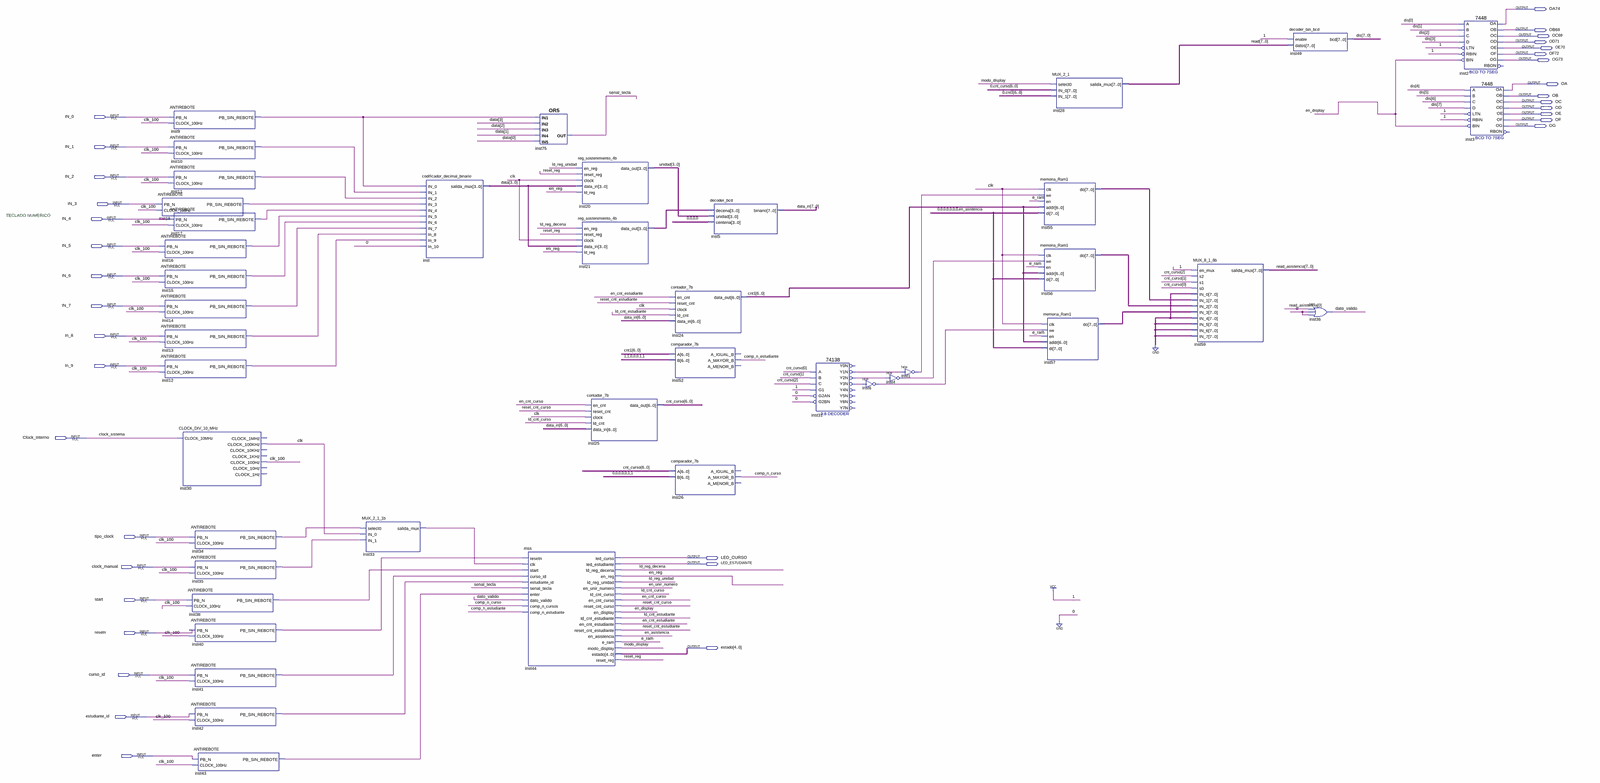
[diagram p0: schematic sheet, whole]
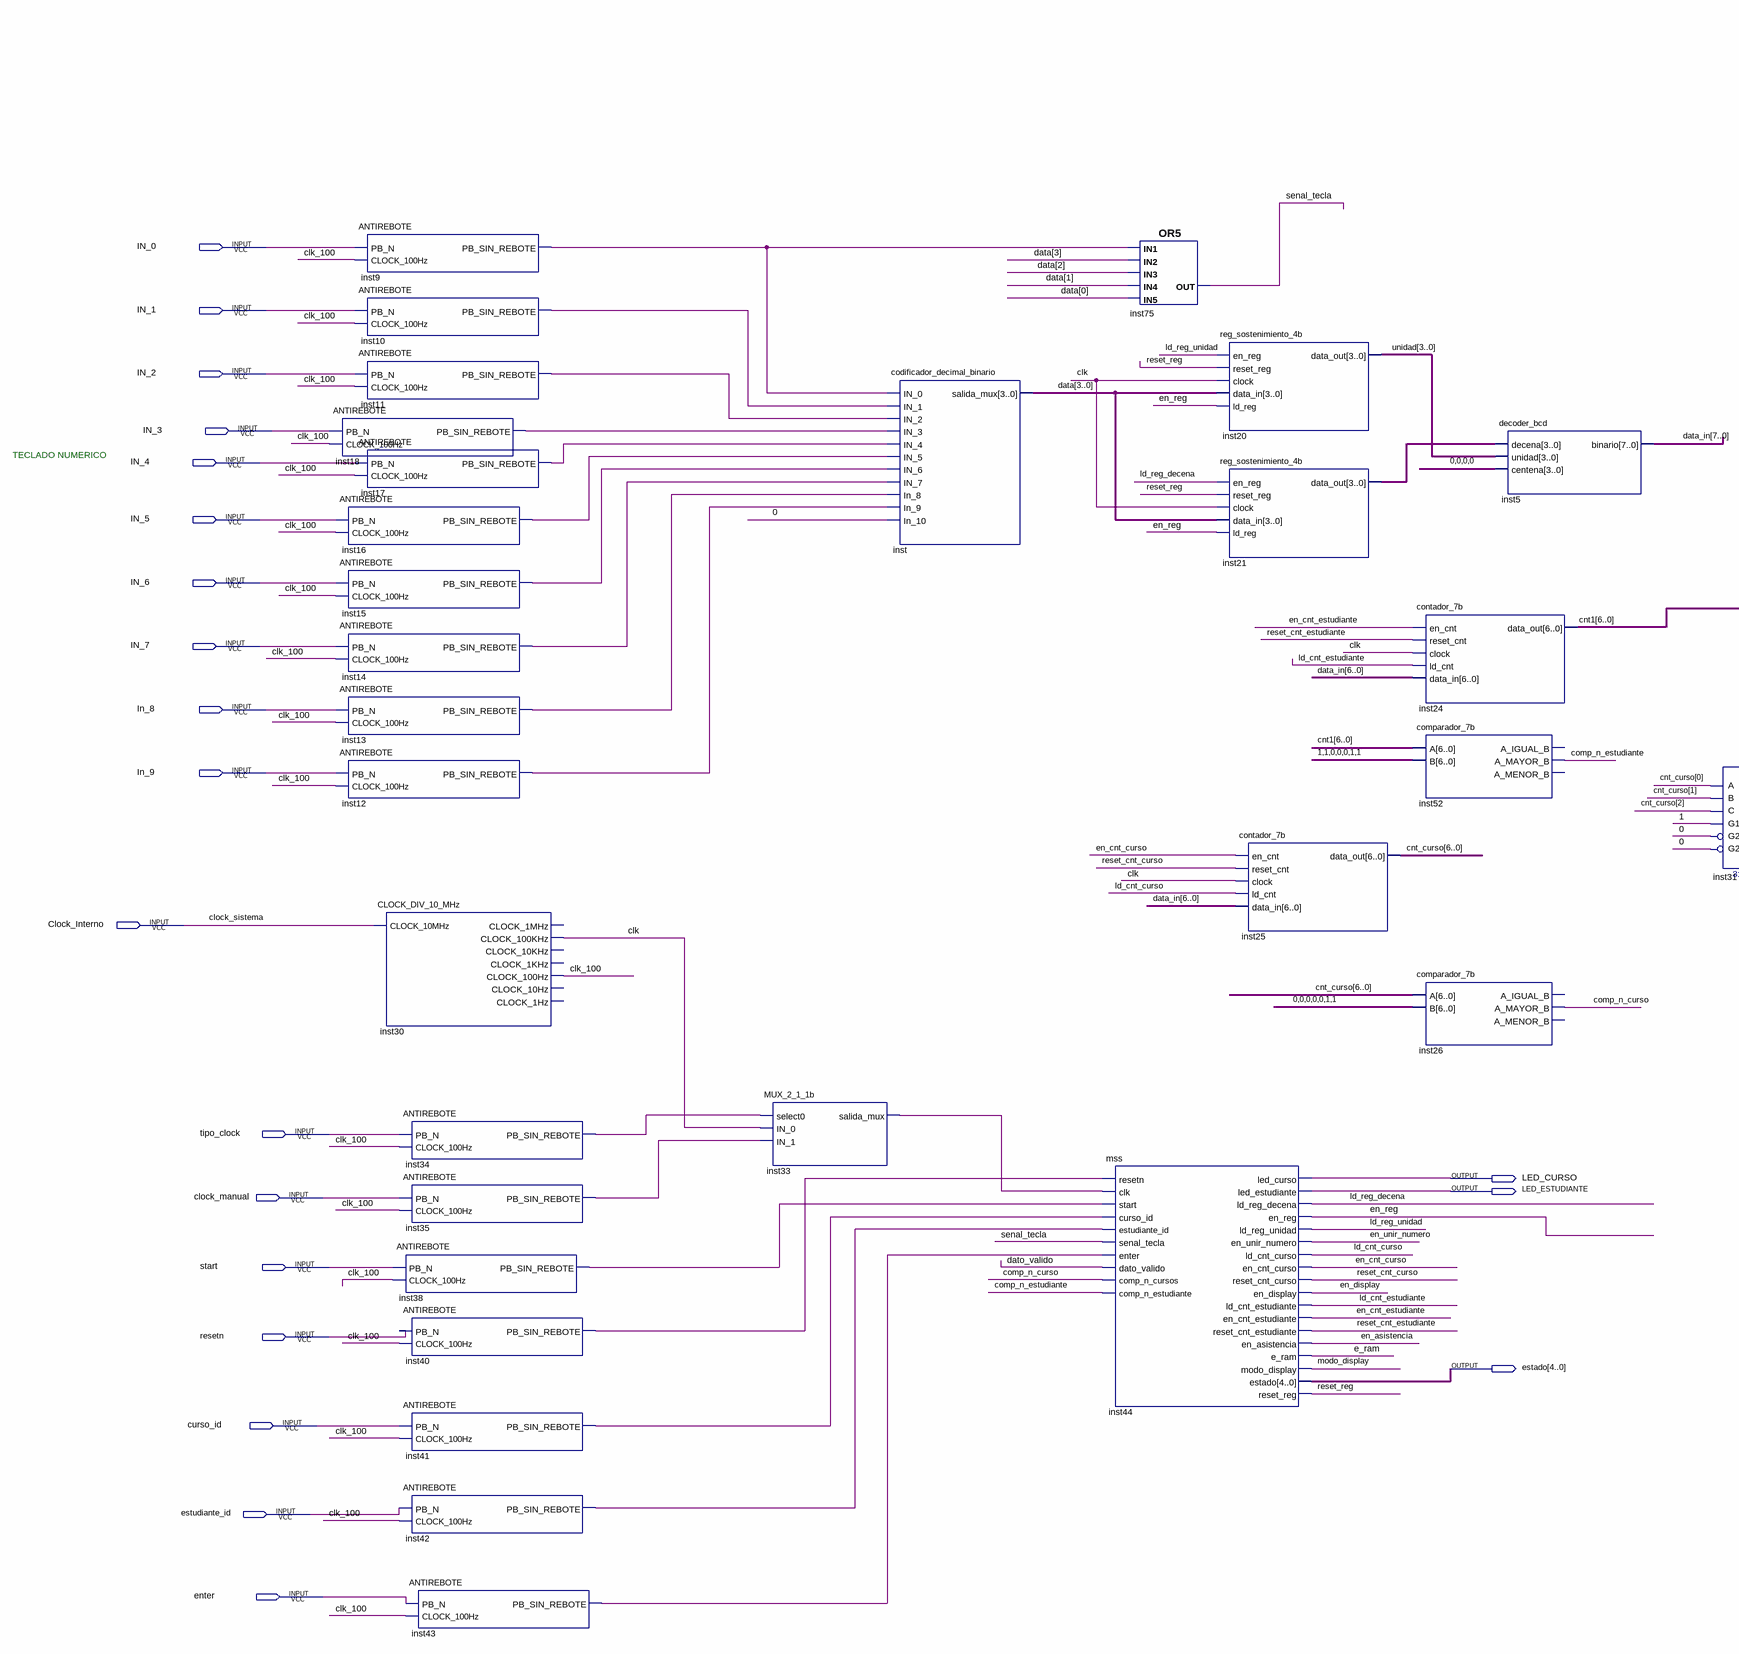
[diagram p1: schematic sheet, left part]
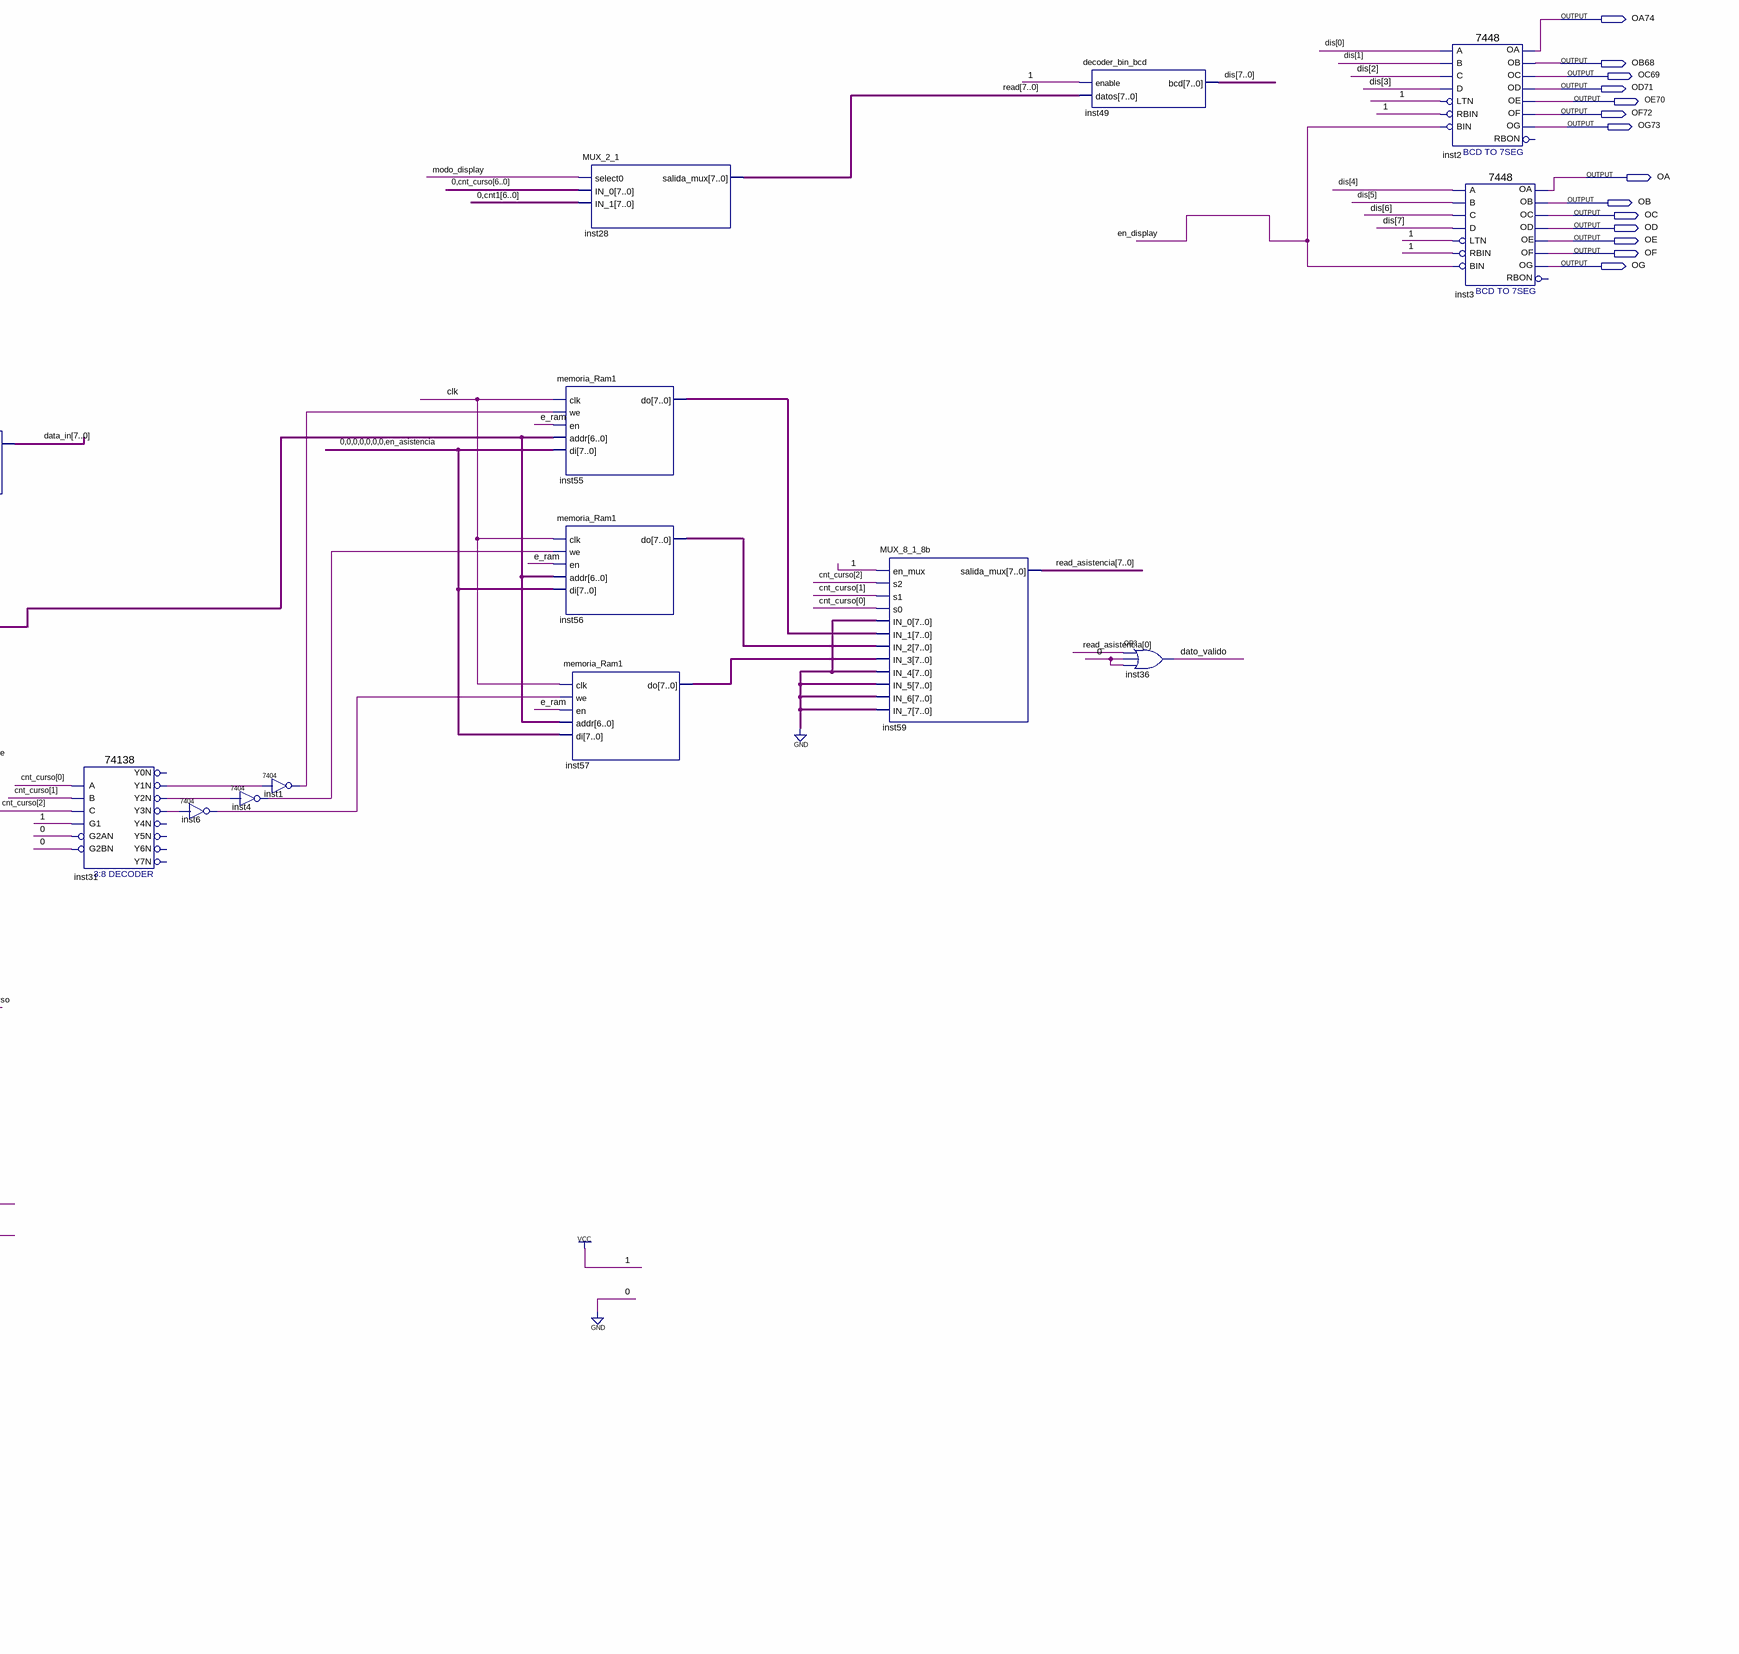
[diagram p2: schematic sheet, right part]
// Quartus schematic marcacionBDF.bdf as structural Verilog: 42 symbols, 35 pins
module marcacionBDF (
  input  IN_0,
  input  IN_1,
  input  IN_2,
  input  IN_3,
  input  IN_4,
  input  IN_5,
  input  IN_6,
  input  IN_7,
  input  In_8,
  input  In_9,
  input  Clock_Interno,
  input  tipo_clock,
  input  clock_manual,
  input  start,
  input  resetn,
  input  curso_id,
  input  estudiante_id,
  input  enter,
  output OA74,
  output OB68,
  output OC69,
  output OD71,
  output OE70,
  output OF72,
  output OG73,
  output OA,
  output OB,
  output OC,
  output OD,
  output OE,
  output OF,
  output OG,
  output LED_CURSO,
  output LED_ESTUDIANTE,
  output [4:0] estado
);

  wire clk, clk_100, comp_n_curso, comp_n_estudiante, dato_valido, e_ram, en_asistencia, en_cnt_curso,
       en_cnt_estudiante, en_display, en_reg, en_unir_numero, inst1_1, inst4_1, inst6_1, inst9_pb_sin_rebote,
       inst10_pb_sin_rebote, inst11_pb_sin_rebote, inst12_pb_sin_rebote, inst13_pb_sin_rebote,
       inst14_pb_sin_rebote, inst15_pb_sin_rebote, inst16_pb_sin_rebote, inst17_pb_sin_rebote,
       inst18_pb_sin_rebote, inst31_y1n, inst31_y2n, inst31_y3n, inst33_salida_mux, inst34_pb_sin_rebote,
       inst35_pb_sin_rebote, inst38_pb_sin_rebote, inst40_pb_sin_rebote, inst41_pb_sin_rebote,
       inst42_pb_sin_rebote, inst43_pb_sin_rebote, ld_cnt_curso, ld_cnt_estudiante, ld_reg_decena,
       ld_reg_unidad, modo_display, reset_cnt_curso, reset_cnt_estudiante, reset_reg, senal_tecla;
  wire [3:0] data, inst21_data_out, unidad;
  wire [6:0] cnt1, cnt_curso;
  wire [7:0] data_in, dis, inst55_do, inst56_do, inst57_do, read, read_asistencia;

  ANTIREBOTE inst9 (.PB_N(IN_0), .CLOCK_100Hz(clk_100), .PB_SIN_REBOTE(inst9_pb_sin_rebote));
  ANTIREBOTE inst10 (.PB_N(IN_1), .CLOCK_100Hz(clk_100), .PB_SIN_REBOTE(inst10_pb_sin_rebote));
  ANTIREBOTE inst11 (.PB_N(IN_2), .CLOCK_100Hz(clk_100), .PB_SIN_REBOTE(inst11_pb_sin_rebote));
  ANTIREBOTE inst18 (.PB_N(IN_3), .CLOCK_100Hz(clk_100), .PB_SIN_REBOTE(inst18_pb_sin_rebote));
  ANTIREBOTE inst17 (.PB_N(IN_4), .CLOCK_100Hz(clk_100), .PB_SIN_REBOTE(inst17_pb_sin_rebote));
  ANTIREBOTE inst16 (.PB_N(IN_5), .CLOCK_100Hz(clk_100), .PB_SIN_REBOTE(inst16_pb_sin_rebote));
  ANTIREBOTE inst15 (.PB_N(IN_6), .CLOCK_100Hz(clk_100), .PB_SIN_REBOTE(inst15_pb_sin_rebote));
  ANTIREBOTE inst14 (.PB_N(IN_7), .CLOCK_100Hz(clk_100), .PB_SIN_REBOTE(inst14_pb_sin_rebote));
  ANTIREBOTE inst13 (.PB_N(In_8), .CLOCK_100Hz(clk_100), .PB_SIN_REBOTE(inst13_pb_sin_rebote));
  ANTIREBOTE inst12 (.PB_N(In_9), .CLOCK_100Hz(clk_100), .PB_SIN_REBOTE(inst12_pb_sin_rebote));
  CLOCK_DIV_10_MHz inst30 (
    .CLOCK_10MHz(Clock_Interno), .CLOCK_100KHz(clk), .CLOCK_100Hz(clk_100));  // open: CLOCK_1MHz, CLOCK_10KHz, CLOCK_1KHz, CLOCK_10Hz, CLOCK_1Hz
  ANTIREBOTE inst34 (.PB_N(tipo_clock), .CLOCK_100Hz(clk_100), .PB_SIN_REBOTE(inst34_pb_sin_rebote));
  ANTIREBOTE inst35 (.PB_N(clock_manual), .CLOCK_100Hz(clk_100), .PB_SIN_REBOTE(inst35_pb_sin_rebote));
  ANTIREBOTE inst38 (.PB_N(start), .CLOCK_100Hz(clk_100), .PB_SIN_REBOTE(inst38_pb_sin_rebote));
  ANTIREBOTE inst40 (.PB_N(resetn), .CLOCK_100Hz(clk_100), .PB_SIN_REBOTE(inst40_pb_sin_rebote));
  ANTIREBOTE inst41 (.PB_N(curso_id), .CLOCK_100Hz(clk_100), .PB_SIN_REBOTE(inst41_pb_sin_rebote));
  ANTIREBOTE inst42 (.PB_N(estudiante_id), .CLOCK_100Hz(clk_100), .PB_SIN_REBOTE(inst42_pb_sin_rebote));
  ANTIREBOTE inst43 (.PB_N(enter), .CLOCK_100Hz(clk_100), .PB_SIN_REBOTE(inst43_pb_sin_rebote));
  MUX_2_1_1b inst33 (
    .select0(inst34_pb_sin_rebote), .IN_0(clk), .IN_1(inst35_pb_sin_rebote), .salida_mux(inst33_salida_mux));
  codificador_decimal_binario inst (
    .IN_0(inst9_pb_sin_rebote), .IN_1(inst10_pb_sin_rebote), .IN_2(inst11_pb_sin_rebote),
    .IN_3(inst18_pb_sin_rebote), .IN_4(inst17_pb_sin_rebote), .IN_5(inst16_pb_sin_rebote),
    .IN_6(inst15_pb_sin_rebote), .IN_7(inst14_pb_sin_rebote), .In_8(inst13_pb_sin_rebote),
    .In_9(inst12_pb_sin_rebote), .In_10(1'b0), .salida_mux(data));
  or inst75 (senal_tecla, inst9_pb_sin_rebote, data[3], data[2], data[1], data[0]);
  mss inst44 (
    .resetn(inst40_pb_sin_rebote), .clk(inst33_salida_mux), .start(inst38_pb_sin_rebote),
    .curso_id(inst41_pb_sin_rebote), .estudiante_id(inst42_pb_sin_rebote), .senal_tecla(senal_tecla),
    .enter(inst43_pb_sin_rebote), .dato_valido(dato_valido), .comp_n_cursos(comp_n_curso),
    .comp_n_estudiante(comp_n_estudiante), .led_curso(LED_CURSO), .led_estudiante(LED_ESTUDIANTE),
    .ld_reg_decena(ld_reg_decena), .en_reg(en_reg), .ld_reg_unidad(ld_reg_unidad),
    .en_unir_numero(en_unir_numero), .ld_cnt_curso(ld_cnt_curso), .en_cnt_curso(en_cnt_curso),
    .reset_cnt_curso(reset_cnt_curso), .en_display(en_display), .ld_cnt_estudiante(ld_cnt_estudiante),
    .en_cnt_estudiante(en_cnt_estudiante), .reset_cnt_estudiante(reset_cnt_estudiante),
    .en_asistencia(en_asistencia), .e_ram(e_ram), .modo_display(modo_display), .estado(estado),
    .reset_reg(reset_reg));
  reg_sostenimiento_4b inst20 (
    .en_reg(ld_reg_unidad), .reset_reg(reset_reg), .clock(clk), .data_in(data), .ld_reg(en_reg),
    .data_out(unidad));
  reg_sostenimiento_4b inst21 (
    .en_reg(ld_reg_decena), .reset_reg(reset_reg), .clock(clk), .data_in(data), .ld_reg(en_reg),
    .data_out(inst21_data_out));
  contador_7b inst25 (
    .en_cnt(en_cnt_curso), .reset_cnt(reset_cnt_curso), .clock(clk), .ld_cnt(ld_cnt_curso),
    .data_in(data_in[6:0]), .data_out(cnt_curso));
  contador_7b inst24 (
    .en_cnt(en_cnt_estudiante), .reset_cnt(reset_cnt_estudiante), .clock(clk), .ld_cnt(ld_cnt_estudiante),
    .data_in(data_in[6:0]), .data_out(cnt1));
  comparador_7b inst52 (.A(cnt1), .B(7'b1100011), .A_MAYOR_B(comp_n_estudiante));  // open: A_IGUAL_B, A_MENOR_B
  comparador_7b inst26 (.A(cnt_curso), .B(7'b0000011), .A_MAYOR_B(comp_n_curso));  // open: A_IGUAL_B, A_MENOR_B
  decoder_bcd inst5 (.decena(inst21_data_out), .unidad(unidad), .centena(4'b0000), .binario(data_in));
  \74138  inst31 (
    .A(cnt_curso[0]), .B(cnt_curso[1]), .G1(1'b1), .C(cnt_curso[2]), .G2AN(1'b0), .G2BN(1'b0),
    .Y1N(inst31_y1n), .Y2N(inst31_y2n), .Y3N(inst31_y3n));  // open: Y0N, Y4N, Y5N, Y6N, Y7N
  \7404  inst6 (.\2 (inst31_y3n), .\1 (inst6_1));
  \7404  inst4 (.\2 (inst31_y2n), .\1 (inst4_1));
  \7404  inst1 (.\2 (inst31_y1n), .\1 (inst1_1));
  memoria_Ram1 inst55 (
    .clk(clk), .we(inst1_1), .en(e_ram), .addr(cnt1), .di({{7{1'b0}}, en_asistencia}), .\do (inst55_do));
  memoria_Ram1 inst56 (
    .clk(clk), .we(inst4_1), .en(e_ram), .addr(cnt1), .di({{7{1'b0}}, en_asistencia}), .\do (inst56_do));
  memoria_Ram1 inst57 (
    .clk(clk), .we(inst6_1), .en(e_ram), .addr(cnt1), .di({{7{1'b0}}, en_asistencia}), .\do (inst57_do));
  MUX_2_1 inst28 (.select0(modo_display), .IN_0({1'b0, cnt_curso}), .IN_1({1'b0, cnt1}), .salida_mux(read));
  MUX_8_1_8b inst59 (
    .en_mux(1'b1), .s2(cnt_curso[2]), .s1(cnt_curso[1]), .s0(cnt_curso[0]), .IN_0({8{1'b0}}),
    .IN_1(inst55_do), .IN_2(inst56_do), .IN_3(inst57_do), .IN_4({8{1'b0}}), .IN_5({8{1'b0}}),
    .IN_6({8{1'b0}}), .IN_7({8{1'b0}}), .salida_mux(read_asistencia));
  decoder_bin_bcd inst49 (.enable(1'b1), .datos(read), .bcd(dis));
  or inst36 (dato_valido, read_asistencia[0], 1'b0, 1'b0);
  \7448  inst2 (
    .A(dis[0]), .C(dis[2]), .D(dis[3]), .B(dis[1]), .RBIN(1'b1), .BIN(en_display), .LTN(1'b1), .OC(OC69),
    .OE(OE70), .OD(OD71), .OF(OF72), .OG(OG73), .OB(OB68), .OA(OA74));  // open: RBON
  \7448  inst3 (
    .A(dis[4]), .C(dis[6]), .D(dis[7]), .B(dis[5]), .RBIN(1'b1), .BIN(en_display), .LTN(1'b1), .OC(OC),
    .OE(OE), .OD(OD), .OF(OF), .OG(OG), .OB(OB), .OA(OA));  // open: RBON

  // Other names for the same wires on the sheet: clock_sistema = Clock_Interno

  // Notes on the sheet:
  //   TECLADO NUMERICO
endmodule
